# EAGLE schematic rw-directish-17mm-mk-1.6 (EAGLE 7.5.0)
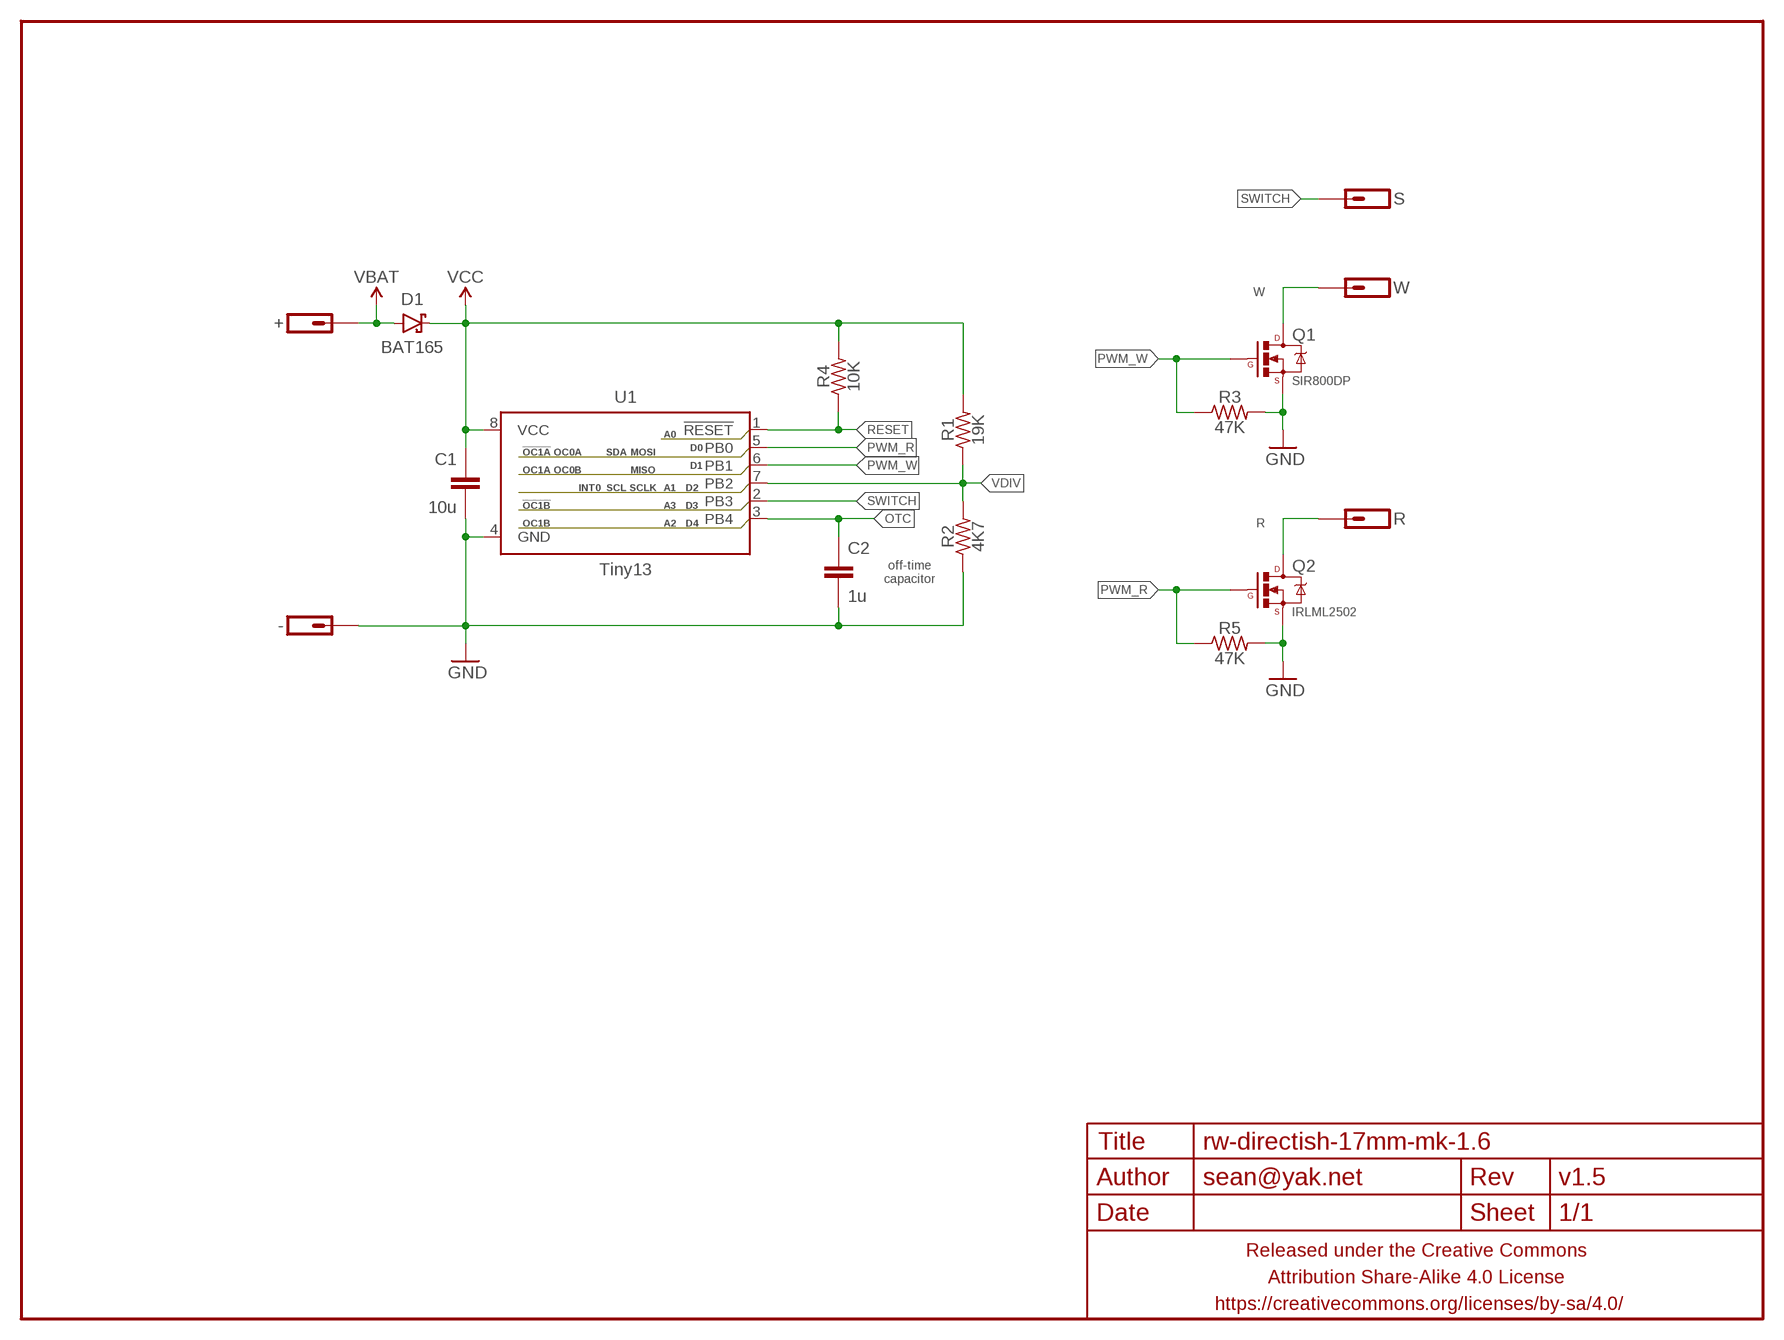
[diagram p0: schematic, sheet 1]

## Parts
+  M01PTH-1MM-CIR-NS  [1X01-1MM-CIR-NS]
-  M01NOT-A-VIA-NOPE  [1X01_NOSILK_NOSTOP]
C1  10u  CAPACITOR-CERAMICC0603-TIGHTER  [C0603-TIGHTER]
C2  1u  CAPACITOR-CERAMICC0402  [C0402]
D1  BAT165  DIODE-SCHOTTKYSOD323  [SOD323-SCHOTTKY]
FRAME1  FRAME-LETTERNO_PACKAGE  [DUMMY]
Q1  SIR800DP  MOSFET-NCHANNELSIR800DP  [POWERPACK-SO-8]
Q2  IRLML2502  MOSFET-NCHANNELIRLML2502-SMOL  [SOT23-CLOSER]
R  M01SMD-1.25MM-DIA  [1X01-SMD-1.25MM-DIA-NS]
R1  19K  RESISTORR0402  [R0402]
R2  4K7  RESISTORR0402  [R0402]
R3  47K  RESISTORR0402  [R0402]
R4  10K  RESISTORR0402  [R0402]
R5  47K  RESISTORR0402  [R0402]
S  M01SMD-1.25MM-DIA  [1X01-SMD-1.25MM-DIA-NS]
U1  Tiny13  ATTINY13SOIC-NARROWPADS  [SO08-NARROWER]
W  M01NOSTOP-CANTSTOP-DONTKNOWHOWTOSTOP  [1X01_SMD_NOSTOP_NOSILK]

## Nets
GND: -.P$1 C1.2 C2.2 Q1.1(S) Q1.2(S) Q1.3(S) Q2.2(S) R2.1 R3.2 R5.2 U1.4(GND)
OTC: C2.1 U1.3(PB4)
PWM_R: Q2.1(G) R5.1 U1.5(PB0)
PWM_W: Q1.4(G) R3.1 U1.6(PB1)
R: Q2.3(D) R.P$1
RESET: R4.1 U1.1(!RESET)
SWITCH: S.P$1 U1.2(PB3)
VBAT: +.1 D1.A
VCC: C1.1 D1.C R1.2 R4.2 U1.8(VCC)
VDIV: R1.1 R2.2 U1.7(PB2)
W: Q1.5678(D) W.1

## Notes on the sheet
- off-time
  capacitor

## Library data of the parts
+ - R S W = a_parts:M01: Header 1 Standard 1-pin 0.1" header. Use with straight break away headers (SKU : PRT-00116), right angle break away headers (PRT-00553), swiss pins (PRT-00743), machine pins (PRT-00117), and female headers (PRT-00115).
C1 C2 = a_parts:CAPACITOR-CERAMIC: CAPACITOR, European symbol
D1 = a_parts:DIODE-SCHOTTKY: Schottky diodes in SFE's production catalog BAT20J 1A 23V 0.62Vf RB751 120mA 40V 0.37Vf PMEG4005EJ 0.5A 40V 0.42Vf MBRA140 1A 40V 0.5Vf B340A 3A 40V SMA
FRAME1 = a_parts:FRAME-LETTER: Schematic Frame Standard 8.5x11 US Letter frame; DESIGNER: sean@yak.net; VERSION: v1.5
Q1 Q2 = a_parts:MOSFET-NCHANNEL: Common NMOSFET Parts MFG P/N Store ID Prod ID FDD8780 TRANS-09984 SI7820DN TRANS-11055 FDS6630A IC-08089 2N7002PW TRANS-11151 FQP30N06L COM-10213 TRANS-10060 BSS123LT1G TRANS-08345 BSS138 TRANS-00830 BS170 2N7000
R1-R5 = a_parts:RESISTOR: RESISTOR, American symbol
U1 = a_parts:ATTINY13: Atmel 8-pin 1kB flash uC